# EasyEDA schematic SCH_GloK_easyeda.json
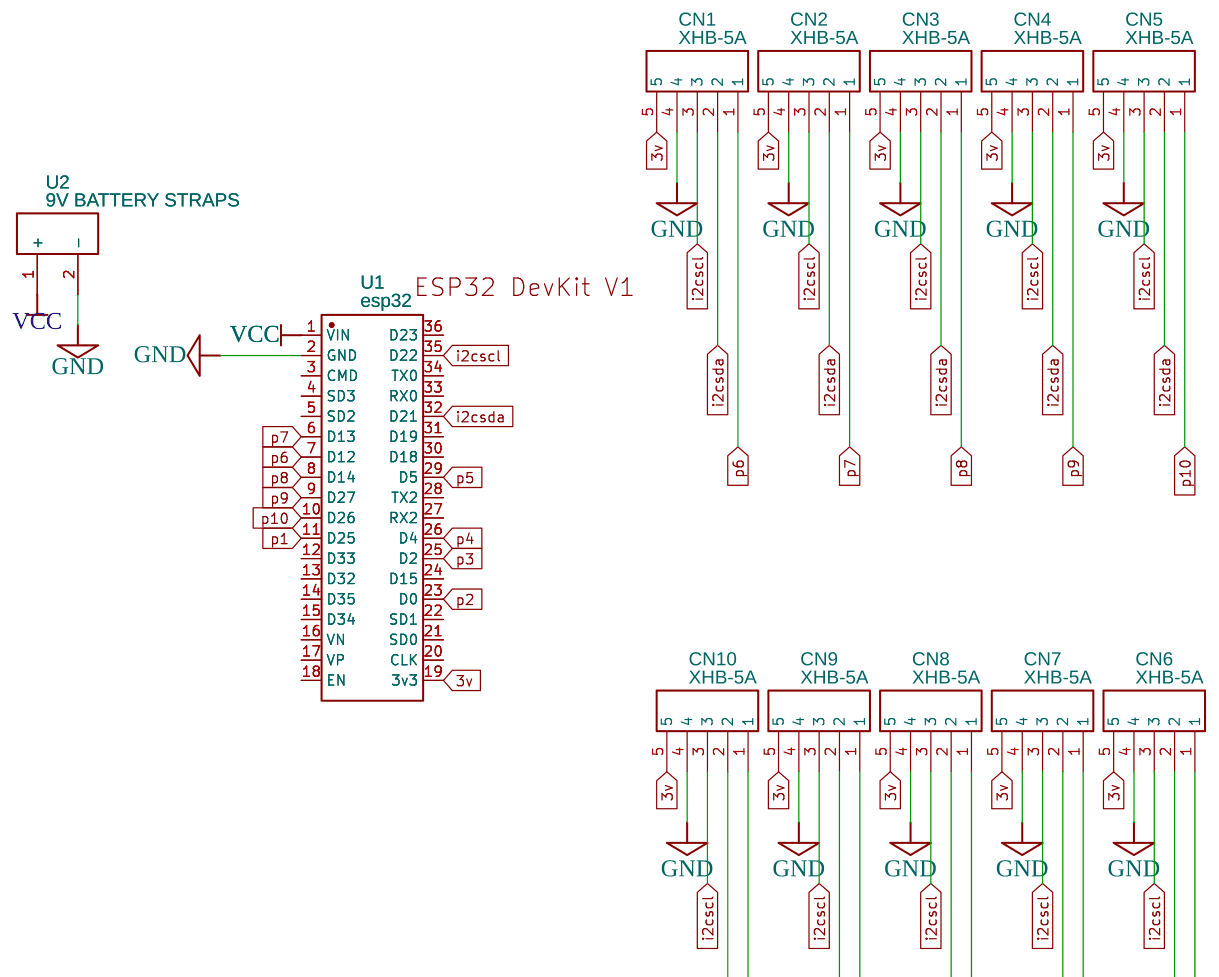
[diagram p0: schematic sheet]

## Parts
CN1  XHB-5A  [XHB-TH_5PIN-V-PITCH2.50-R]
CN2  XHB-5A  [XHB-TH_5PIN-V-PITCH2.50-R]
CN3  XHB-5A  [XHB-TH_5PIN-V-PITCH2.50-R]
CN4  XHB-5A  [XHB-TH_5PIN-V-PITCH2.50-R]
CN5  XHB-5A  [XHB-TH_5PIN-V-PITCH2.50-R]
CN6  XHB-5A  [XHB-TH_5PIN-V-PITCH2.50-R]
CN7  XHB-5A  [XHB-TH_5PIN-V-PITCH2.50-R]
CN8  XHB-5A  [XHB-TH_5PIN-V-PITCH2.50-R]
CN9  XHB-5A  [XHB-TH_5PIN-V-PITCH2.50-R]
CN10  XHB-5A  [XHB-TH_5PIN-V-PITCH2.50-R]
U1  esp32  [ESP32 DEVKIT V1]
U2  9V BATTERY STRAPS  [9V BATTERY STRAPS]

## Library data of the parts
CN1-CN10 = XHB-5A: Supplier: LCSC; Manufacturer: BOOMELE(博穆精密); Supplier Part: C66559; JLCPCB Part Class: Extended Part
U1 = esp32: Supplier Part: ESP32; Contributor: byluginnikita
U2 = 9V BATTERY STRAPS: Manufacturer: Keystone Electronics; Manufacturer Part: 233; Supplier: Digi-Key; Supplier Part: 36-233-ND; link: https://www.keyelco.com/userAssets/file/M65p30.pdf; Contributor: JimmyBones

## Nets
3v: CN1.5 CN2.5 CN3.5 CN4.5 CN5.5 CN6.5 CN7.5 CN8.5 CN9.5 CN10.5 U1.19(3v3)
GND: CN1.4 CN2.4 CN3.4 CN4.4 CN5.4 CN6.4 CN7.4 CN8.4 CN9.4 CN10.4 U1.2(GND) U2.2(-)
VCC: U1.1(VIN) U2.1(+)
i2cscl: CN1.3 CN2.3 CN3.3 CN4.3 CN5.3 CN6.3 CN7.3 CN8.3 CN9.3 CN10.3 U1.35(D22)
i2csda: CN1.2 CN2.2 CN3.2 CN4.2 CN5.2 CN6.2 CN7.2 CN8.2 CN9.2 CN10.2 U1.32(D21)
p1: CN10.1 U1.11(D25)
p2: CN9.1 U1.23(D0)
p3: CN8.1 U1.25(D2)
p4: CN7.1 U1.26(D4)
p5: CN6.1 U1.29(D5)
p6: CN1.1 U1.7(D12)
p7: CN2.1 U1.6(D13)
p8: CN3.1 U1.8(D14)
p9: CN4.1 U1.9(D27)
p10: CN5.1 U1.10(D26)

Not connected (* = marked no-connect by the designer): U1 3(CMD) 4(SD3) 5(SD2) 12(D33) 13(D32) 14(D35) 15(D34) 16(VN) 17(VP) 18(EN) 20(CLK) 21(SD0) 22(SD1) 24(D15) 27(RX2) 28(TX2) 30(D18) 31(D19) 33(RX0) 34(TX0) 36(D23)
